# EAGLE design board (EAGLE 9.2.2)
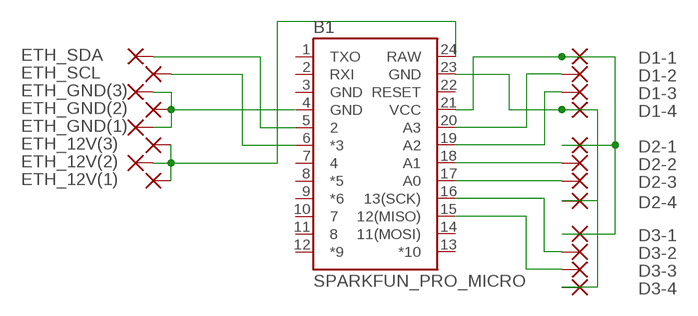
[diagram p0: schematic, sheet 1]

## Parts
B1  SPARKFUN_PRO_MICRO  [SPARKFUN_PRO_MICRO]
D1-1  2,15/1,0  [2,15/1,0]
D1-2  2,15/1,0  [2,15/1,0]
D1-3  2,15/1,0  [2,15/1,0]
D1-4  2,15/1,0  [2,15/1,0]
D2-1  2,15/1,0  [2,15/1,0]
D2-2  2,15/1,0  [2,15/1,0]
D2-3  2,15/1,0  [2,15/1,0]
D2-4  2,15/1,0  [2,15/1,0]
D3-1  2,15/1,0  [2,15/1,0]
D3-2  2,15/1,0  [2,15/1,0]
D3-3  2,15/1,0  [2,15/1,0]
D3-4  2,15/1,0  [2,15/1,0]
ETH_12V(1)  2,15/1,0  [2,15/1,0]
ETH_12V(2)  2,15/1,0  [2,15/1,0]
ETH_12V(3)  2,15/1,0  [2,15/1,0]
ETH_GND(1)  2,15/1,0  [2,15/1,0]
ETH_GND(2)  2,15/1,0  [2,15/1,0]
ETH_GND(3)  2,15/1,0  [2,15/1,0]
ETH_SCL  2,15/1,0  [2,15/1,0]
ETH_SDA  2,15/1,0  [2,15/1,0]

## Nets
N$1: B1.4(GND) ETH_GND(1).1(P) ETH_GND(2).1(P) ETH_GND(3).1(P)
N$2: B1.23(GND) D1-4.1(P) D2-4.1(P) D3-4.1(P)
N$3: B1.21(VCC) D1-1.1(P) D2-1.1(P) D3-1.1(P)
N$5: B1.19(A2) D1-3.1(P)
N$6: B1.20(A3) D1-2.1(P)
N$7: B1.18(A1) D2-2.1(P)
N$8: B1.17(A0) D2-3.1(P)
N$9: B1.16(13(SCK)) D3-2.1(P)
N$10: B1.15(12(MISO)) D3-3.1(P)
N$11: B1.24(RAW) ETH_12V(1).1(P) ETH_12V(2).1(P) ETH_12V(3).1(P)
N$12: B1.5 ETH_SDA.1(P)
N$13: B1.6(*3) ETH_SCL.1(P)
Unconnected: B1.1(TXO) B1.2(RXI) B1.7 B1.8(*5) B1.9(*6) B1.10 B1.11 B1.12(*9) B1.13(*10) B1.14(11(MOSI)) B1.22(RESET)

## Power pins joined to a net without a drawn wire
GND: B1.3(GND)

## Library data of the parts
B1 = SparkFun-Boards:SPARKFUN_PRO_MICRO: SparkFun Pro Micro Atmega32U4 compatible footprint. SparkFun Products: 3.3V/8MHz <https://www.sparkfun.com/products/12587> 5V/16MHz <https://www.sparkfun.com/products/12640>
D1-1-D1-4 D2-1-D2-4 D3-1-D3-4 ETH_12V(1) ETH_12V(2) ETH_12V(3) ETH_GND(1) ETH_GND(2) ETH_GND(3) ETH_SCL ETH_SDA = wirepad:2,15/1,0: THROUGH-HOLE PAD

## Net classes
0 default: width 1.25 mm, clearance 0.5 mm

## Board
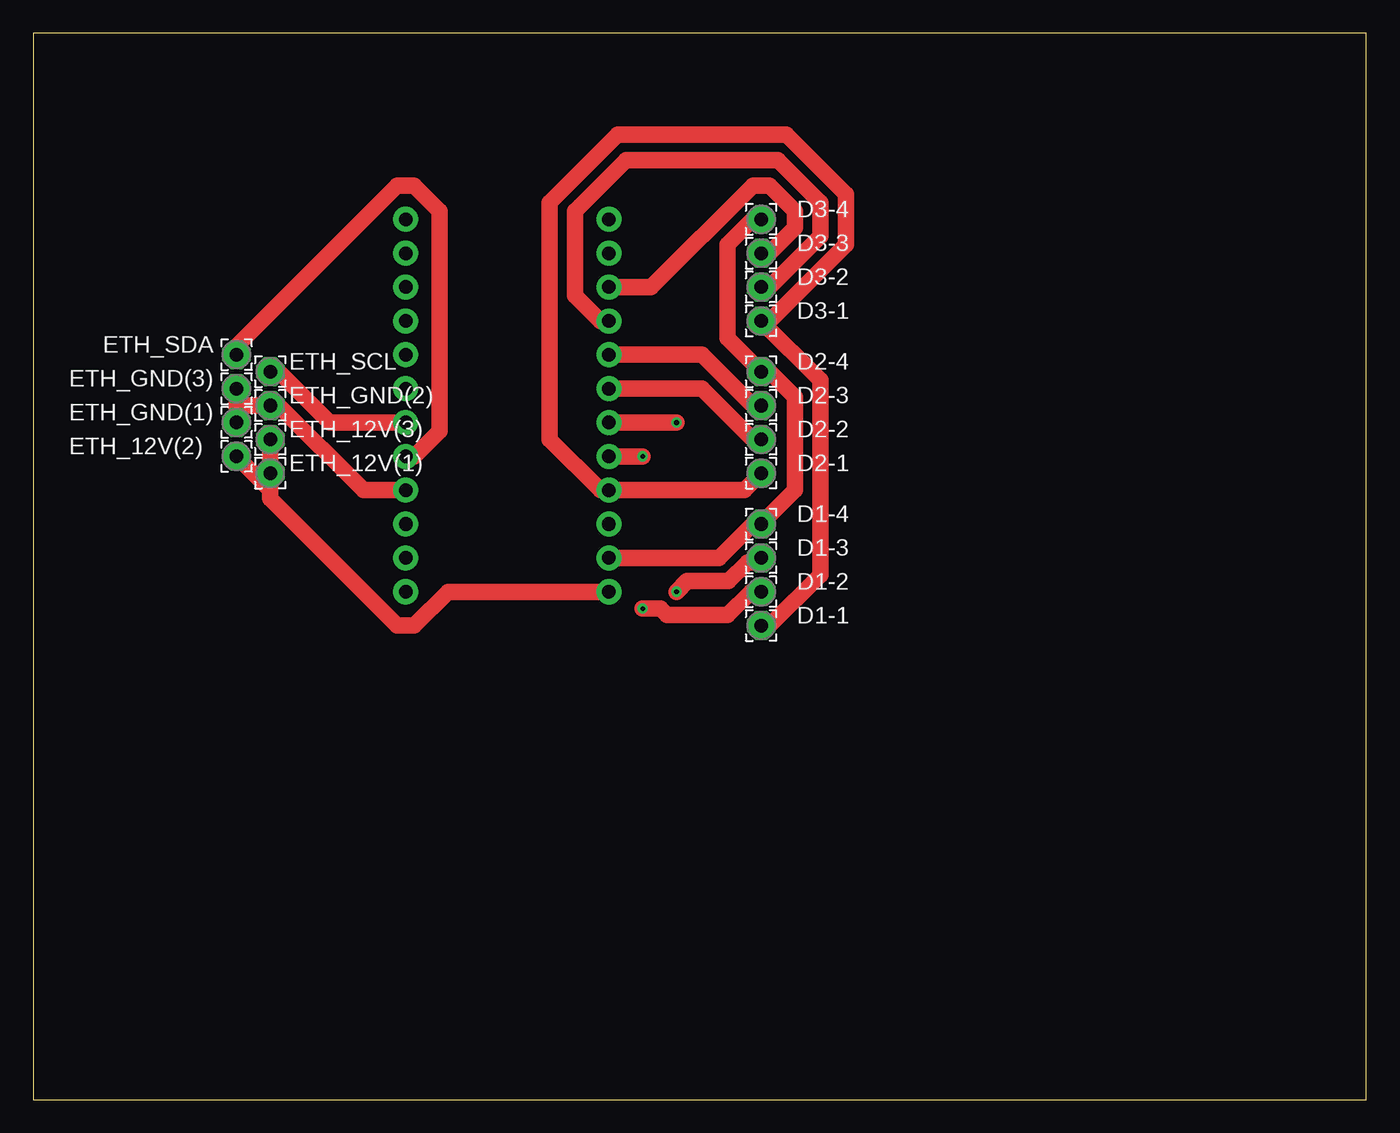
[diagram p1: board, top side]
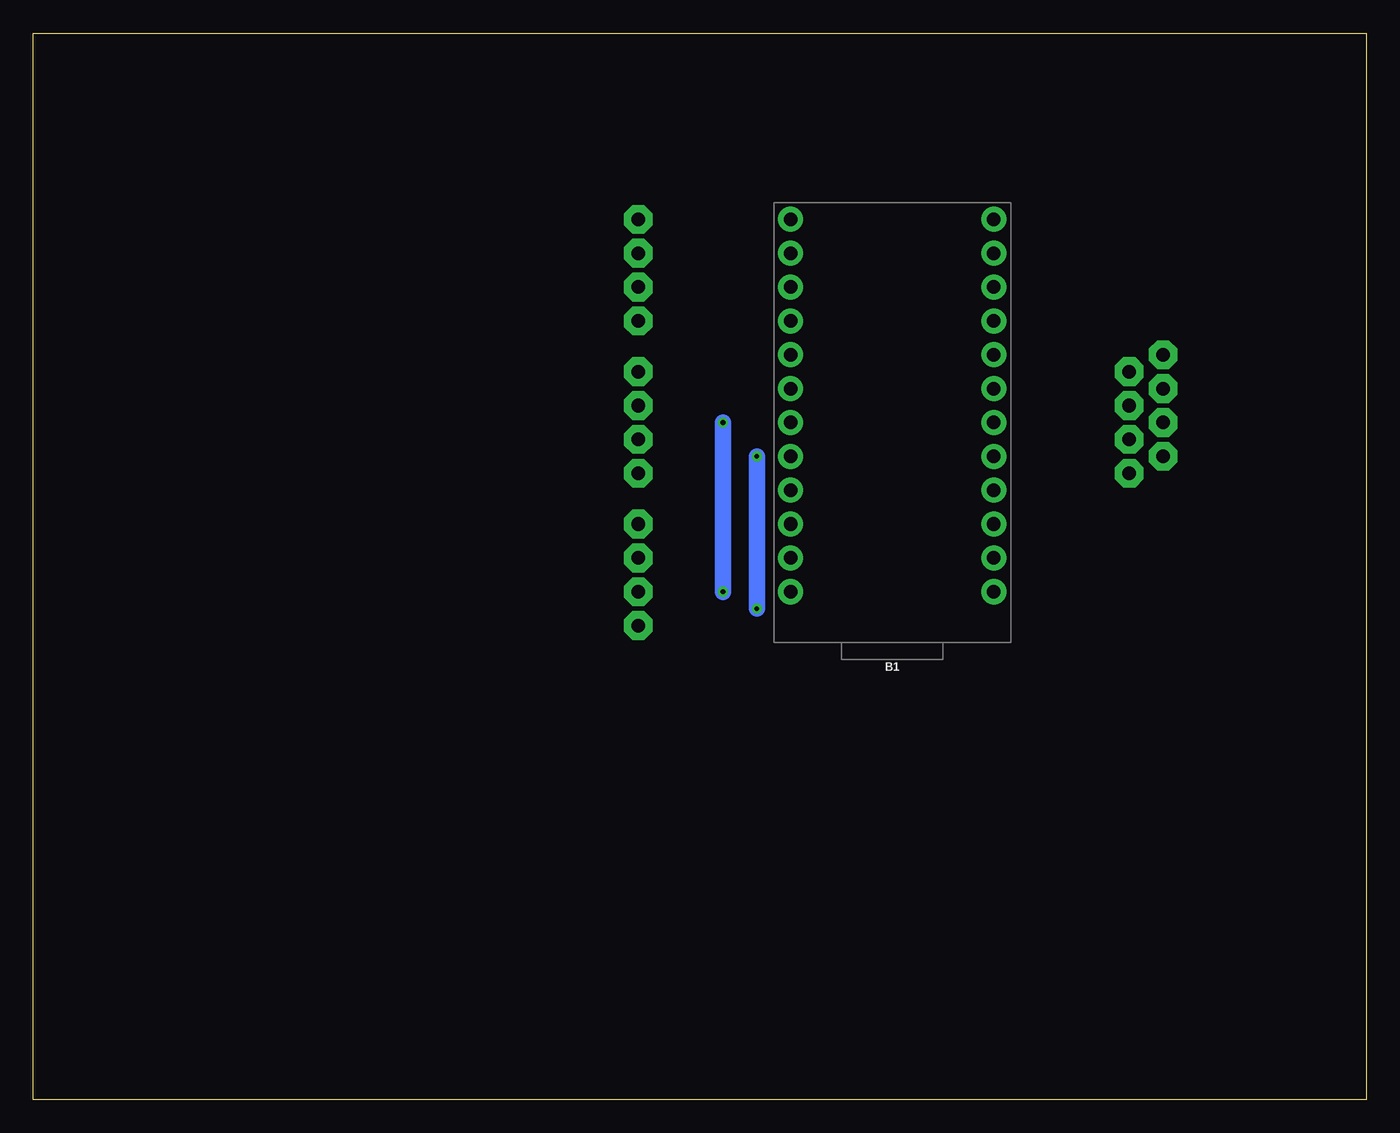
[diagram p2: board, bottom side, seen from below]

Size 100 x 80 mm. Coordinates in mm from the lower left corner, seen from the top.
Outline: 0,0 100,0 100,80 0,80 0,0
Copper layers (1*16): Top 0.035mm / dielectric 1.5mm / Bottom 0.035mm
Design rules "default": minimum track width 6mil, minimum drill 0.35mm, track to track 6mil, track to pad 6mil, pad to pad 6mil, via to via 6mil, smd to smd 6mil, copper to edge 40mil, drill to drill 6mil, minimum pad ring 10mil, minimum via ring 8mil, stop-mask expansion 4mil, vias tented up to drill 0mil, thermal gap 10mil

### Footprints (pad centres in the part's own frame; a part is rotated, then mirrored left to right if it is on the bottom)
SPARKFUN_PRO_MICRO = drill 1.016 pad 1.88: 1 -7.62,12.7; 2 -7.62,10.16; 3 -7.62,7.62; 4 -7.62,5.08; 5 -7.62,2.54; 6 -7.62,0; 7 -7.62,-2.54; 8 -7.62,-5.08; 9 -7.62,-7.62; 10 -7.62,-10.16; 11 -7.62,-12.7; 12 -7.62,-15.24; 13 7.62,-15.24; 14 7.62,-12.7; 15 7.62,-10.16; 16 7.62,-7.62; 17 7.62,-5.08; 18 7.62,-2.54; 19 7.62,0; 20 7.62,2.54; 21 7.62,5.08; 22 7.62,7.62; 23 7.62,10.16; 24 7.62,12.7
2,15/1,0 = drill 1.016 pad 2.159 octagon: 1 0,0

### Placement (x,y rotation side)
B1  35.56,50.8 180 bottom
D1-1  54.61,35.56 0 top
D1-2  54.61,38.1 0 top
D1-3  54.61,40.64 0 top
D1-4  54.61,43.18 0 top
D2-1  54.61,46.99 0 top
D2-2  54.61,49.53 0 top
D2-3  54.61,52.07 0 top
D2-4  54.61,54.61 0 top
D3-1  54.61,58.42 0 top
D3-2  54.61,60.96 0 top
D3-3  54.61,63.5 0 top
D3-4  54.61,66.04 0 top
ETH_12V(1)  17.78,46.99 0 top
ETH_12V(2)  15.24,48.26 0 top
ETH_12V(3)  17.78,49.53 0 top
ETH_GND(1)  15.24,50.8 0 top
ETH_GND(2)  17.78,52.07 0 top
ETH_GND(3)  15.24,53.34 0 top
ETH_SCL  17.78,54.61 0 top
ETH_SDA  15.24,55.88 0 top

### Tracks (layer width: path | path; a pad name or v marks a point on that pad's centre or on a via)
N$1
  Top 1.25: ETH_GND(3).1 15.24,52.07 | 15.24,52.07 ETH_GND(1).1 | B1.4 24.77,45.72 18.41,52.07 ETH_GND(2).1 15.24,52.07
N$2
  Top 1.25: D3-4.1 53.98,66.04 52.07,64.14 52.07,57.15 D2-4.1 55.24,54.61 57.15,52.7 57.15,45.72 D1-4.1 53.98,43.18 51.44,40.64 B1.23
N$3
  Top 1.25: D2-1.1 53.34,45.72 B1.21 42.55,45.72 38.73,49.53 38.73,67.31 43.81,72.39 56.52,72.39 60.96,67.94 60.96,64.14 55.24,58.42 D3-1.1 59.05,53.98 59.05,39.37 55.24,35.56 D1-1.1
N$5  (via drill 0.35)
  Top 1.25: B1.19 v48.26,50.8 | D1-3.1 54.27,40.3 53.57,40.3 52.16,38.89 49.05,38.89 v48.26,38.1
  Bottom 1.25: v48.26,50.8 v48.26,38.1
N$6  (via drill 0.35)
  Top 1.25: B1.20 v45.72,48.26 | D1-2.1 53.84,38.1 52.09,36.35 47.53,36.35 47.05,36.83 v45.72,36.83
  Bottom 1.25: v45.72,48.26 v45.72,36.83
N$7
  Top 1.25: B1.18 50.16,53.34 53.98,49.53 D2-2.1
N$8
  Top 1.25: B1.17 50.16,55.88 53.98,52.07 D2-3.1
N$9
  Top 1.25: B1.16 42.55,58.42 40.64,60.33 40.64,66.67 44.45,70.48 55.88,70.48 59.05,67.31 59.05,64.77 55.24,60.96 D3-2.1
N$10
  Top 1.25: B1.15 46.35,60.96 53.98,68.58 55.24,68.58 57.15,66.67 57.15,65.41 55.24,63.5 D3-3.1
N$11
  Top 1.25: B1.24 31.11,38.1 28.57,35.56 27.3,35.56 17.78,45.09 17.78,45.72 | 17.78,45.72 ETH_12V(1).1 ETH_12V(3).1 | 17.78,45.72 ETH_12V(2).1
N$12
  Top 1.25: B1.5 28.57,48.26 30.48,50.16 30.48,66.67 28.57,68.58 27.3,68.58 15.24,56.52 ETH_SDA.1
N$13
  Top 1.25: B1.6 22.23,50.8 18.41,54.61 ETH_SCL.1